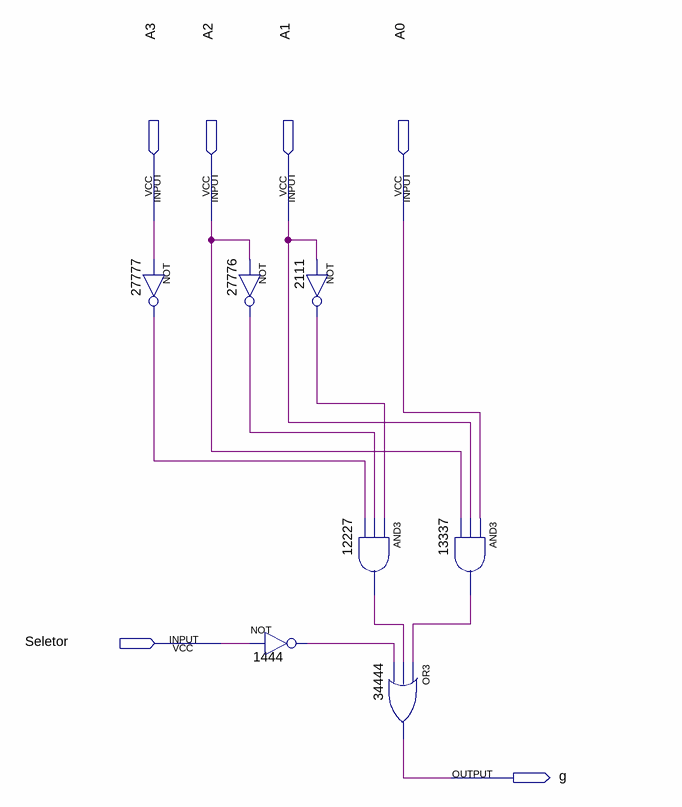
[diagram p0: schematic sheet]
// Quartus schematic segmento_g.bdf as structural Verilog: 7 symbols, 6 pins
module segmento_g (
  input  A3,
  input  A2,
  input  A1,
  input  A0,
  input  Seletor,
  output g
);

  wire n1444_out, n2111_out, n12227_out, n13337_out, n27776_out, n27777_out;

  not u_27777 (n27777_out, A3);
  not u_27776 (n27776_out, A2);
  not u_1444 (n1444_out, Seletor);
  not u_2111 (n2111_out, A1);
  and u_12227 (n12227_out, n2111_out, n27776_out, n27777_out);
  or u_34444 (g, n13337_out, n12227_out, n1444_out);
  and u_13337 (n13337_out, A0, A1, A2);
endmodule
